# EAGLE design Stepper_Controller (EAGLE 9.6.2)
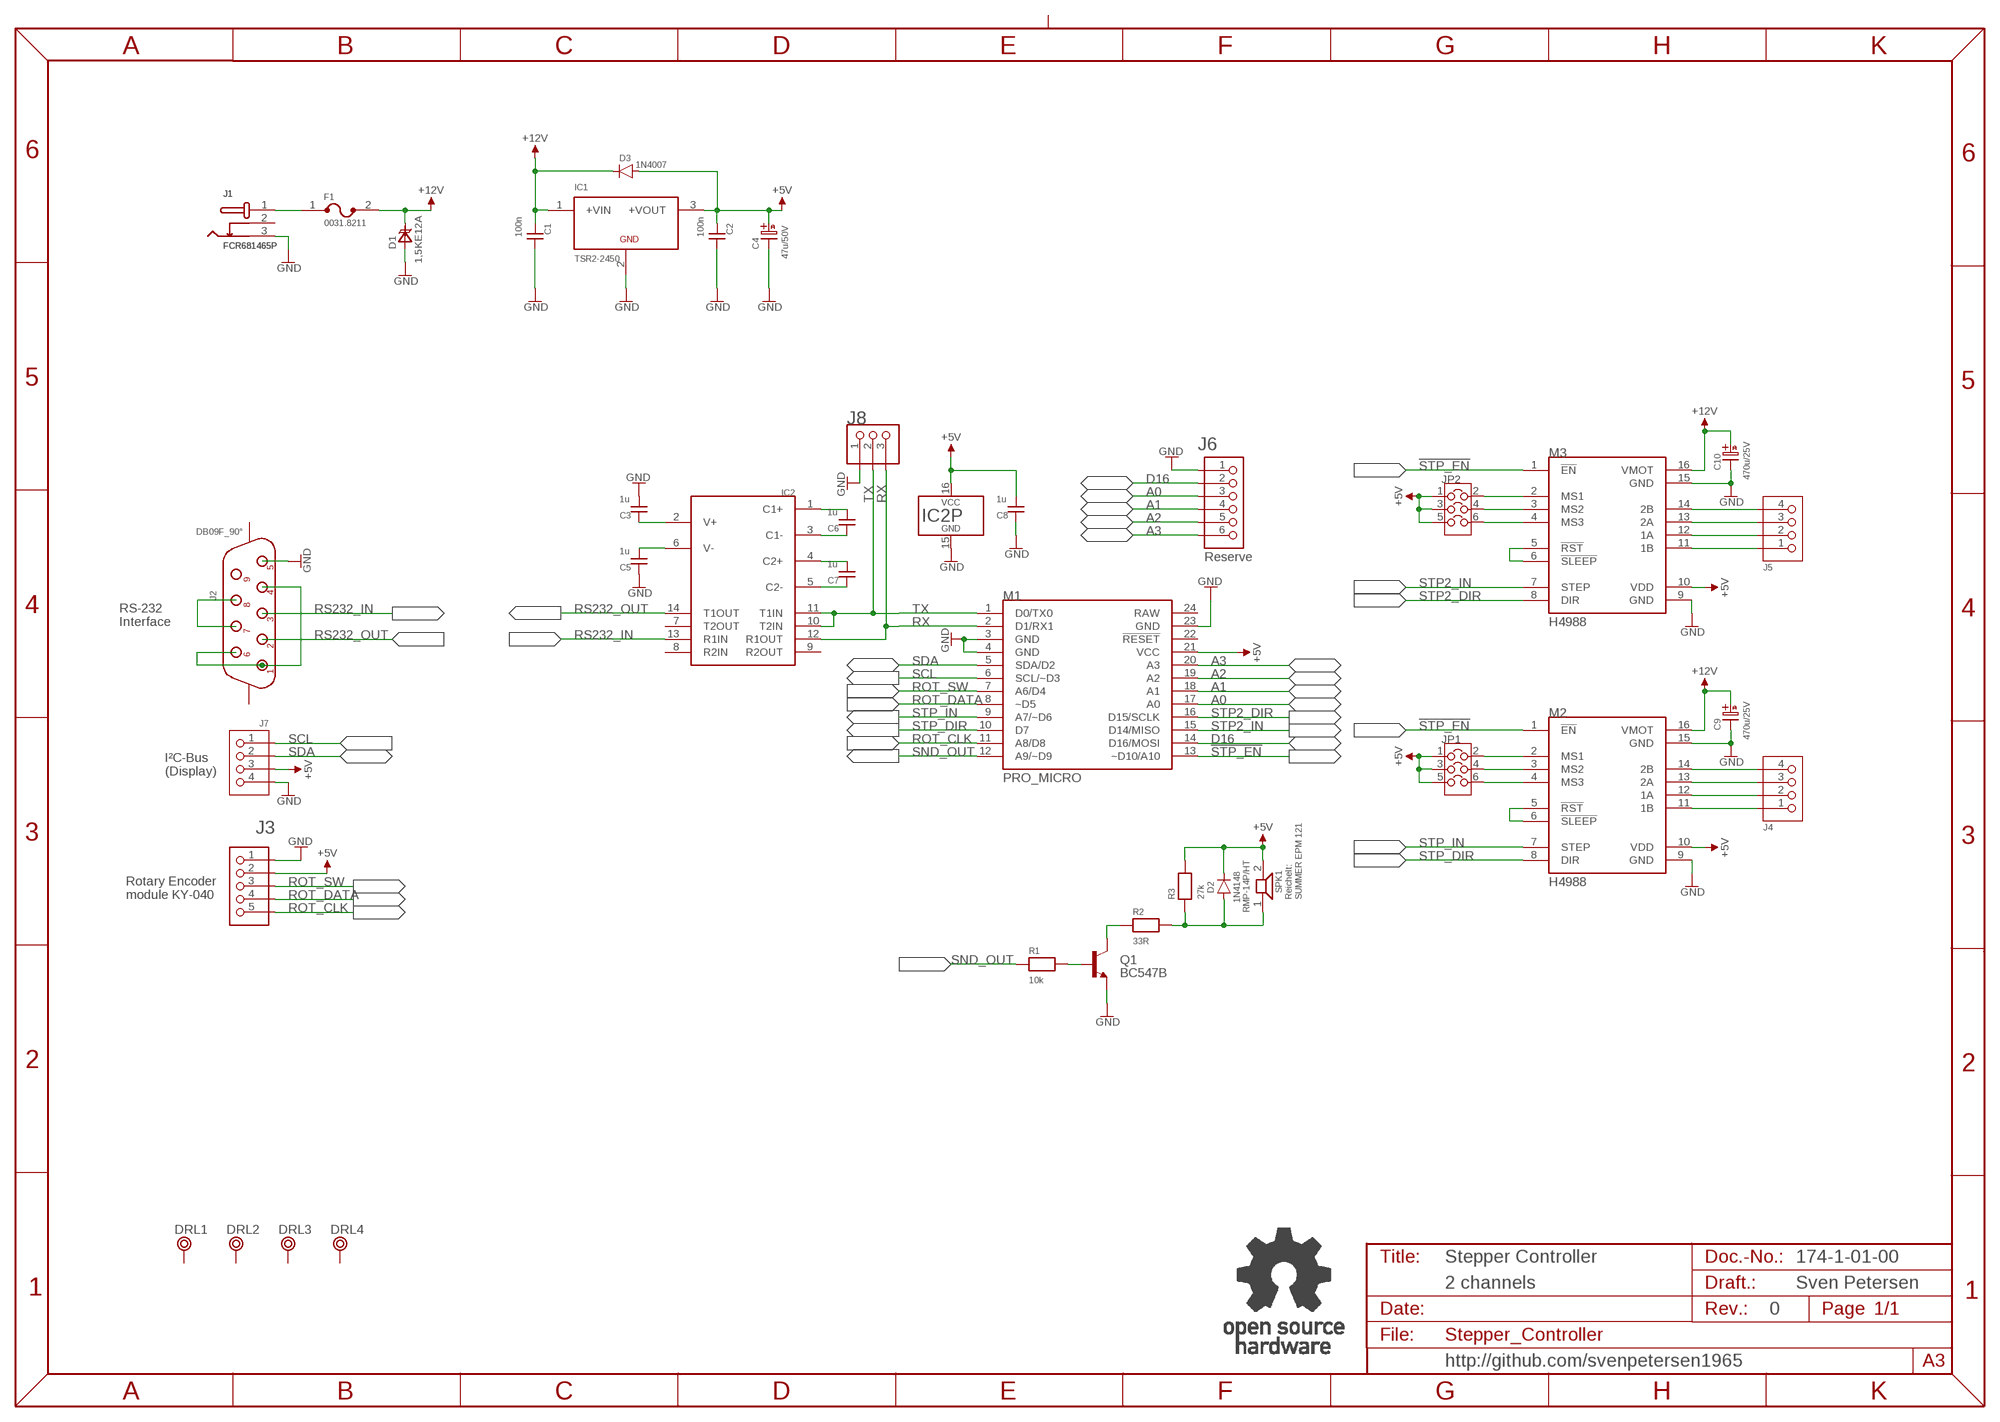
[diagram p0: schematic, sheet 1]

## Parts
C1  100n  CAP01  [C-2,5]
C2  100n  CAP01  [C-2,5]
C3  1u  CAP02  [C-5]
C4  47u/50V  C07/2,5  [C07/2,5]
C5  1u  CAP02  [C-5]
C6  1u  CAP02  [C-5]
C7  1u  CAP02  [C-5]
C8  1u  CAP02  [C-5]
C9  470u/25V  C08/3,5  [C08/3,5]
C10  470u/25V  C08/3,5  [C08/3,5]
D1  1,5KE12A  [DO-201]
D2  1N4148  [DO-35]
D3  1N4007  [DO-41]
DRL1  BOHR3,5  [BOHR3,5]
DRL2  BOHR3,5  [BOHR3,5]
DRL3  BOHR3,5  [BOHR3,5]
DRL4  BOHR3,5  [BOHR3,5]
F1  0031.8211  [0031.8211]
IC1  TSR2-2450  TSR2  [TSR2]
IC2  MAX-232  [DIL-16]
J1  FCR681465P  [FCR681465P]
J2  DB09F_90°  DS09F-H-CL  [DS09F-H]
J3  6410-5P  [6410-5P]
J4  6410-4P  [6410-4P]
J5  6410-4P  [6410-4P]
J6  PINHD-1X6  [1X06]
J7  6410-4P  [6410-4P]
J8  PINHD-1X3  [1X03]
JP1  COMBI-3X2P  [COMBI-3X2]
JP2  COMBI-3X2P  [COMBI-3X2]
M1  PRO_MICRO  [PRO_MICRO]
M2  H4988  [H4988]
M3  H4988  [H4988]
Q1  BC547B  [TO92]
R1  10k  RES04  [R-10]
R2  33R  RES04  [R-10]
R3  27k  RES04  [R-10]
SPK1  RMP-14P/HT  [RMP-14P/HT]
U$2  OPEN_SOURCE_HW  [OPENHW]

## Nets
!STP_EN: M1.13(~D10/A10) M2.1(!EN) M3.1(!EN)
+5V: C2.1 C4.A(+) C8.2 D2.K D3.A IC1.3(+VOUT) IC2.16(VCC) J3.2 J7.3 JP1.1 JP1.3 JP1.5 JP2.1 JP2.3 JP2.5 M1.21(VCC) M2.10(VDD) M3.10(VDD) R3.2 SPK1.2
+12V: C1.1 C9.+ C10.+ D1.K D3.K F1.2 IC1.1(+VIN) M2.16(VMOT) M3.16(VMOT)
A0: J6.3 M1.17(A0)
A1: J6.4 M1.18(A1)
A2: J6.5 M1.19(A2)
A3: J6.6 M1.20(A3)
D16: J6.2 M1.14(D16/MOSI)
GND: C1.2 C2.2 C3.2 C4.K(-) C5.1 C8.1 C9.- C10.- D1.A IC1.2(GND) IC2.15(GND) J1.3 J2.5 J3.1 J6.1 J7.4 J8.1 M1.3(GND) M1.4(GND) M1.23(GND) M2.9(GND) M2.15(GND) M3.9(GND) M3.15(GND) Q1.1(E)
N$1: F1.1 J1.1
N$2: Q1.3(C) R2.1
N$3: Q1.2(B) R1.2
N$4: J2.1 J2.4 J2.6
N$5: J2.7 J2.8
N$6: C7.2 IC2.4(C2+)
N$7: C7.1 IC2.5(C2-)
N$8: C6.1 IC2.3(C1-)
N$9: C6.2 IC2.1(C1+)
N$10: D2.A R2.2 R3.1 SPK1.1
N$11: C3.1 IC2.2(V+)
N$12: C5.2 IC2.6(V-)
N$13: M2.5(!RST) M2.6(!SLEEP)
N$14: M3.5(!RST) M3.6(!SLEEP)
N$15: JP2.2 M3.2(MS1)
N$16: JP2.4 M3.3(MS2)
N$17: JP2.6 M3.4(MS3)
N$18: JP1.2 M2.2(MS1)
N$19: JP1.4 M2.3(MS2)
N$20: JP1.6 M2.4(MS3)
N$21: J4.1 M2.11(1B)
N$22: J4.2 M2.12(1A)
N$23: J4.3 M2.13(2A)
N$24: J4.4 M2.14(2B)
N$25: J5.1 M3.11(1B)
N$26: J5.2 M3.12(1A)
N$27: J5.3 M3.13(2A)
N$28: J5.4 M3.14(2B)
ROT_CLK: J3.5 M1.11(A8/D8)
ROT_DATA: J3.4 M1.8(~D5)
ROT_SW: J3.3 M1.7(A6/D4)
RS232_IN: IC2.13(R1IN) J2.3
RS232_OUT: IC2.14(T1OUT) J2.2
RX: IC2.12(R1OUT) J8.3 M1.2(D1/RX1)
SCL: J7.1 M1.6(SCL/~D3)
SDA: J7.2 M1.5(SDA/D2)
SND_OUT: M1.12(A9/~D9) R1.1
STP2_DIR: M1.16(D15/SCLK) M3.8(DIR)
STP2_IN: M1.15(D14/MISO) M3.7(STEP)
STP_DIR: M1.10(D7) M2.8(DIR)
STP_IN: M1.9(A7/~D6) M2.7(STEP)
TX: IC2.10(T2IN) IC2.11(T1IN) J8.2 M1.1(D0/TX0)
Unconnected: DRL1.P$1 DRL2.P$1 DRL3.P$1 DRL4.P$1 IC2.7(T2OUT) IC2.8(R2IN) IC2.9(R2OUT) J1.2 J2.9 J2.PE1 J2.PE2 M1.22(!RESET)

## Notes on the sheet
- Reserve
- RS-232 
  Interface
- I²C-Bus
  (Display)
- Rotary Encoder
  module KY-040
- Reichelt:
  SUMMER EPM 121
- Stepper Controller | 174-1-01-00
- 2 channels | Sven Petersen
- 0
- http://github.com/svenpetersen1965

## Power pins joined to a net without a drawn wire
RAW: M1.24(RAW)

## Library data of the parts
C1 C2 = DISCRETE:CAP01
C3 C5-C8 = DISCRETE:CAP02
C4 = ELCO:C07/2,5
C9 C10 = ELCO:C08/3,5
D1 = ST:1,5KE12A
D2 = Dioden:1N4148
D3 = Dioden:1N4007
DRL1-DRL4 = Mech_Bohr:BOHR3,5
F1 = Schurter:0031.8211
IC1 = Traco:TSR2
IC2 = MAXIM:MAX-232
J1 = Cliff:FCR681465P
J2 = Connec:DS09F-H-CL
J3 = MOLEX:6410-5P: 6410/22-27-2051
J4 J5 J7 = MOLEX:6410-4P: 6410/22-27-2041
J6 = PINHEAD:PINHD-1X6
J8 = PINHEAD:PINHD-1X3
JP1 JP2 = Cutpad:COMBI-3X2P
M1 = Arduino:PRO_MICRO
M2 M3 = modules:H4988
Q1 = Transistoren:BC547*: NPN Transistor
R1-R3 = DISCRETE:RES04
SPK1 = KM:RMP-14P/HT
U$2 = Logo:OPEN_SOURCE_HW

## Board
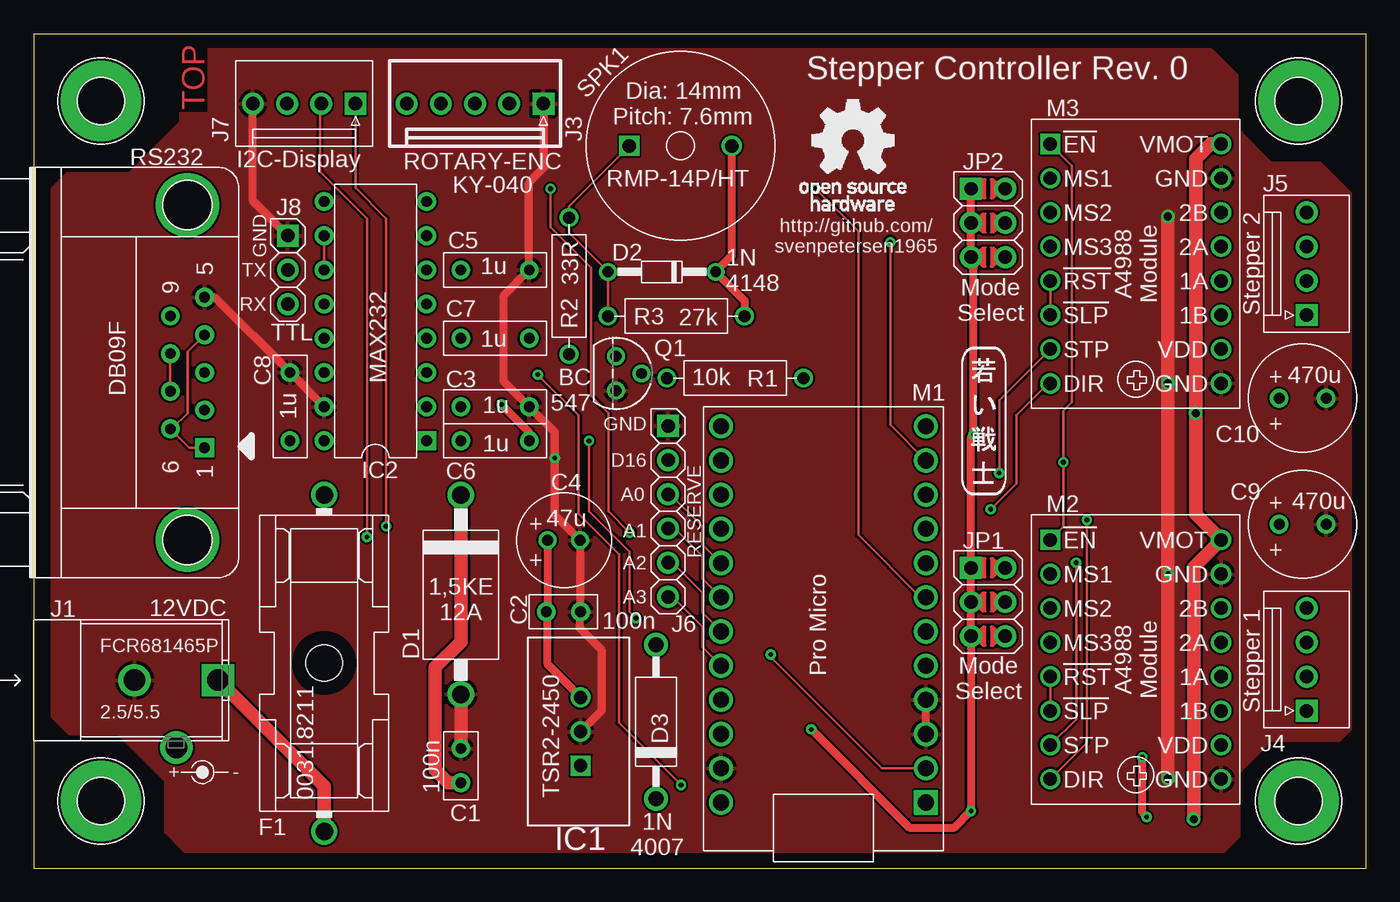
[diagram p1: board, top side]
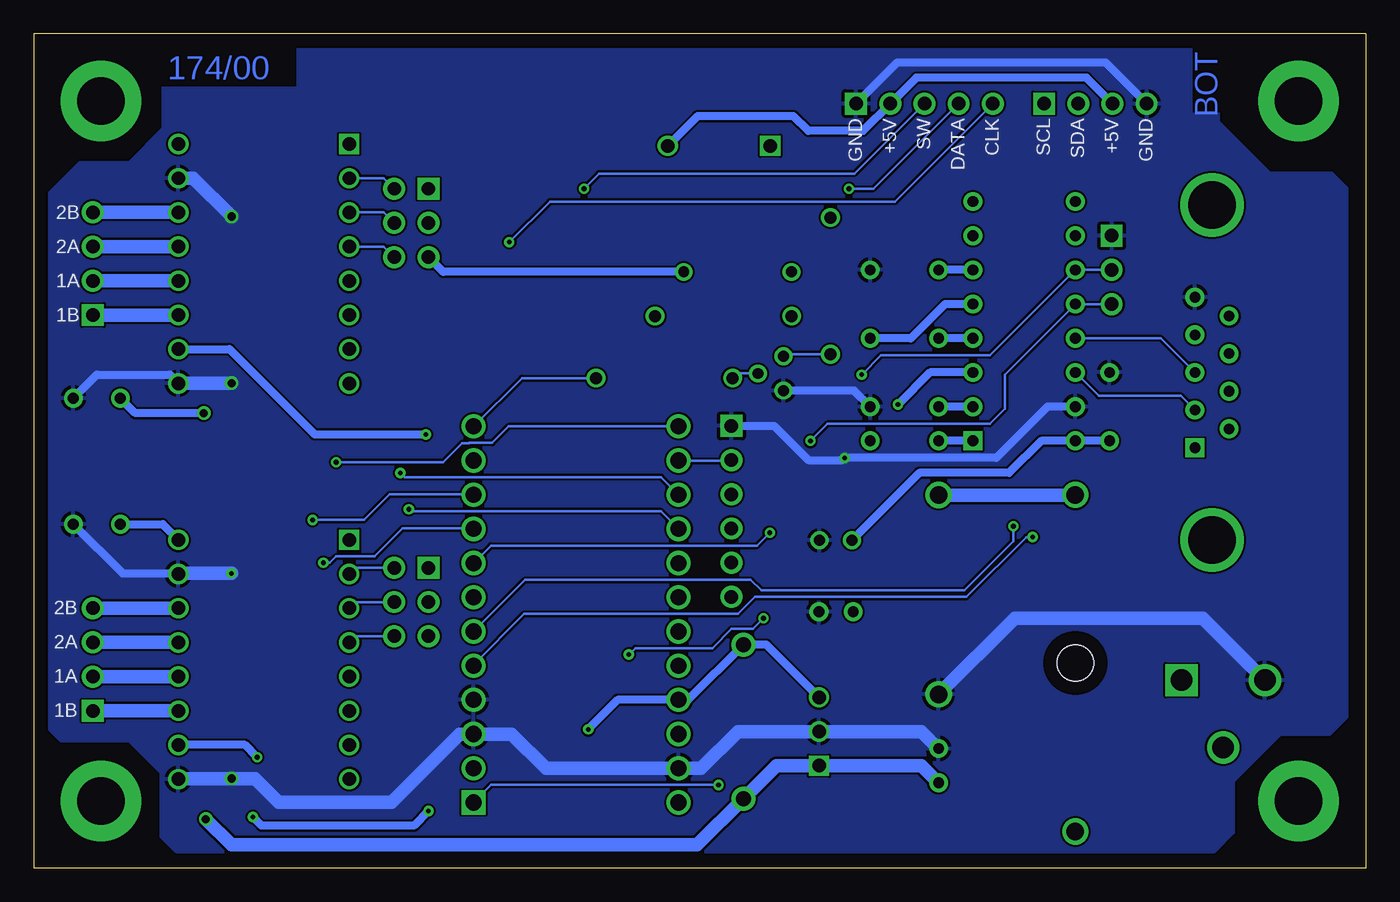
[diagram p2: board, bottom side, seen from below]

Size 99 x 62 mm. Coordinates in mm from the lower left corner, seen from the top.
Outline: 0,0 99,0 99,62 0,62 0,0
Copper layers (1*16): Top 0.035mm / dielectric 1.5mm / Bottom 0.035mm
Design rules "default *": minimum track width 6mil, minimum drill 0.35mm, track to track 6mil, track to pad 6mil, pad to pad 6mil, via to via 6mil, smd to smd 6mil, copper to edge 40mil, drill to drill 6mil, minimum pad ring 10mil, minimum via ring 8mil, stop-mask expansion 4mil, vias tented up to drill 25mil, thermal gap 10mil
bRestrict: 2 lines

### Footprints (pad centres in the part's own frame; a part is rotated, then mirrored left to right if it is on the bottom)
C-2,5 = drill 0.8 pad 1.397: 1 -1.27,0; 2 1.27,0
C-5 = drill 0.8 pad 1.397: 1 -2.54,0; 2 2.54,0
C07/2,5 = drill 0.813 pad 1.27: A -1.202,0; K 1.202,0
C08/3,5 = drill 0.813 pad 1.397: + -1.746,0; - 1.746,0
DO-201 = drill 1.3: A -7.4,0; K 7.4,0
DO-35 = drill 0.8: A -4,0; K 4,0
DO-41 = drill 1.118 pad 1.778: A 5.715,0; K -5.715,0
BOHR3,5 = drill 3.5 pad 6: P$1 0,0
0031.8211 = drill 1.3: 1 -12.5,0; 2 12.5,0 | hole 2.7: 0,0
TSR2 = drill 1 square: 1 -2.54,0 | drill 1: 2 0,0; 3 2.54,0
DIL-16 = drill 0.8 pad 1.397 square: 1 -7.62,-3.81 | drill 0.8 pad 1.397: 2 -5.08,-3.81; 3 -2.54,-3.81; 4 0,-3.81; 5 2.54,-3.81; 6 5.08,-3.81; 7 7.62,-3.81; 8 10.16,-3.81; 9 10.16,3.81; 10 7.62,3.81; 11 5.08,3.81; 12 2.54,3.81; 13 0,3.81; 14 -2.54,3.81; 15 -5.08,3.81; 16 -7.62,3.81
FCR681465P = drill 1.6 square: 1 0,13.7 | drill 1.6: 2 5,10.6; 3 0,7.5
DS09F-H = drill 0.787 pad 1.397 square: 1 -5.588,-1.27 | drill 0.787 pad 1.397: 2 -2.794,-1.27; 3 0,-1.27; 4 2.794,-1.27; 5 5.588,-1.27; 6 -4.191,1.27; 7 -1.397,1.27; 8 1.397,1.27; 9 4.191,1.27 | drill 3.505 pad 4.724: PE1 -12.446,0; PE2 12.446,0
6410-5P = drill 1 pad 1.626 square: 1 -5.08,0 | drill 1 pad 1.626: 2 -2.54,0; 3 0,0; 4 2.54,0; 5 5.08,0
6410-4P = drill 1 pad 1.626 square: 1 -3.81,0 | drill 1 pad 1.626: 2 -1.27,0; 3 1.27,0; 4 3.81,0
1X06 = drill 1 pad 1.626 square: 1 -6.35,0 | drill 1 pad 1.626: 2 -3.81,0; 3 -1.27,0; 4 1.27,0; 5 3.81,0; 6 6.35,0
1X03 = drill 1 pad 1.626 square: 1 -2.54,0 | drill 1 pad 1.626: 2 0,0; 3 2.54,0
COMBI-3X2 = drill 1 pad 1.626 square: 1 -1.27,2.54 | drill 1 pad 1.626: 2 1.27,2.54; 3 -1.27,0; 4 1.27,0; 5 -1.27,-2.54; 6 1.27,-2.54
PRO_MICRO = drill 1.2 square: 1 -7.62,13.97 | drill 1.2: 2 -7.62,11.43; 3 -7.62,8.89; 4 -7.62,6.35; 5 -7.62,3.81; 6 -7.62,1.27; 7 -7.62,-1.27; 8 -7.62,-3.81; 9 -7.62,-6.35; 10 -7.62,-8.89; 11 -7.62,-11.43; 12 -7.62,-13.97; 13 7.62,-13.97; 14 7.62,-11.43; 15 7.62,-8.89; 16 7.62,-6.35; 17 7.62,-3.81; 18 7.62,-1.27; 19 7.62,1.27; 20 7.62,3.81; 21 7.62,6.35; 22 7.62,8.89; 23 7.62,11.43; 24 7.62,13.97
H4988 = drill 1 square: 1 -6.35,8.89 | drill 1: 2 -6.35,6.35; 3 -6.35,3.81; 4 -6.35,1.27; 5 -6.35,-1.27; 6 -6.35,-3.81; 7 -6.35,-6.35; 8 -6.35,-8.89; 9 6.35,-8.89; 10 6.35,-6.35; 11 6.35,-3.81; 12 6.35,-1.27; 13 6.35,1.27; 14 6.35,3.81; 15 6.35,6.35; 16 6.35,8.89
TO92 = drill 0.813: 1 1.27,0; 2 0,1.905; 3 -1.27,0
R-10 = drill 0.889 pad 1.397: 1 -5.08,0; 2 5.08,0
RMP-14P/HT = drill 1 square: 1 0,3.8 | drill 1: 2 0,-3.8

### Placement (x,y rotation side)
C1  31.75,7.62 90 top
C2  39.37,19.05 0 top
C3  34.29,34.29 0 top
C4  39.4,24.36 0 top
C5  34.29,44.45 180 top
C6  34.29,31.75 180 top
C7  34.29,39.37 180 top
C8  19.05,34.29 270 top
C9  94.3,25.56 0 top
C10  94.3,34.92 0 top
D1  31.75,20.32 90 top
D2  46.69,44.3 0 top
D3  46.26,10.89 90 top
DRL1  5,5 0 top
DRL2  5,57 0 top
DRL3  94,5 0 top
DRL4  94,57 0 top
F1  21.59,15.24 90 top
IC1  40.64,10.16 90 top
IC2  25.4,39.37 90 top
J1  0,13.97 270 top
J2  11.43,36.83 90 top
J3  32.8,56.8 180 top
J4  94.6,15.51 90 top
J5  94.6,44.91 90 top
J6  47.15,26.51 270 top
J7  20.1,56.8 180 top
J8  18.89,44.45 270 top
JP1  70.93,19.78 0 top
JP2  70.93,47.94 0 top
M1  58.69,18.86 180 top
M2  81.9,15.51 0 top
M3  81.9,44.91 0 top
Q1  43.27,36.76 270 top
R1  52.13,36.42 180 top
R2  39.78,43.26 90 top
R3  47.75,41.02 0 top
SPK1  48.07,53.67 90 top
U$2  56.95,48.84 0 top
U$59  [PCB-TITLE/]  0,72 0 top  (outside the outline)
U$71  [SVEN_TAG]  70.64,33.34 0 top
U$77  [2LAYER]  12.7,56.36 90 top

### Tracks (layer width: path | path; a pad name or v marks a point on that pad's centre or on a via)
!STP_EN  (via drill 0.35)
  Top 0.203: M2.1 76.52,25.37 v76.52,30.16 76.52,33.97 77.15,34.61 77.15,52.2 M3.1
  Bottom 0.203: M1.13 63.69,32.83 64.92,31.6 66.63,31.6 66.64,31.59 67.15,31.59 68.58,30.16 v76.52,30.16
+5V  (via drill 0.35)
  Top 0.61: JP2.1 JP2.3 JP2.5 69.66,44.81 69.85,44.63 v69.85,32.23 69.66,32.04 JP1.1 JP1.3 JP1.5 v69.66,4.25 68.42,3.02 65.09,3.02 v57.78,10.32 | C4.A 38.2,19.15 | 38.2,19.15 C2.1 | SPK1.2 51.87,45.49 D2.K 52.83,42.16 R3.2 | IC1.3 38.2,15.14 38.2,19.15 | v82.71,3.81 82.39,4.13 v82.39,8.26
  Bottom 0.61: M3.10 84.44,38.56 78.11,32.23 v69.85,32.23 | C8.2 IC2.16 24.13,31.75 26.51,29.37 33.18,29.37 38.19,24.36 C4.A | J7.3 20.77,58.74 33.4,58.74 J3.2 37.37,54.77 41.43,54.77 42.55,55.88 49.66,55.88 SPK1.2 | IC1.3 44.55,16.61 D3.A 50.35,12.51 M1.21 55.59,12.51 v57.78,10.32 | v69.66,4.25 70.74,3.17 82.07,3.17 v82.71,3.81 | v82.39,8.26 83.3,9.16 M2.10 | D2.K 68.56,44.3 JP2.5
+12V  (via drill 0.6)
  Top 1.016: C1.1 30.8,6.35 29.84,7.3 29.84,14.92 31.75,16.83 D1.K | M3.16 88.23,53.82 87.47,53.82 86.36,52.7 v86.36,33.81 86.36,26.29 M2.16 86.2,22.35 v86.2,3.65
  Bottom 0.61: C9.+ 89.41,25.56 M2.16 | v86.36,33.81 91.44,33.81 C10.+
  Bottom 1.016: C1.1 33.02,7.62 IC1.1 43.81,7.62 D3.K 49.69,1.75 84.3,1.75 v86.2,3.65 | D1.K 21.61,27.72 F1.2
A0
  Top 0.203: M1.17 49.69,24.05 49.69,25.4 47.31,27.78 J6.3
A1
  Top 0.203: M1.18 49.69,21.51 49.69,23.18 47.62,25.24 J6.4
A2
  Top 0.203: M1.19 49.69,18.97 49.69,20.48 47.47,22.7 J6.5
A3
  Top 0.203: M1.20 49.69,16.43 49.69,17.94 47.47,20.16 J6.6
D16
  Bottom 0.203: M1.14 47.18,30.29 J6.2
GND  (via drill 0.35, 0.6)
  Top 0.61: M1.3 M1.4 | 40.6,19.09 C4.K 38.73,26.23 v38.73,30.48 38.73,32.38 C3.2 34.92,36.2 34.92,42.55 C5.1 36.83,50.96 37.94,52.07 37.94,56.74 J3.1 | 40.6,19.09 C2.2 | IC1.2 42.23,11.75 42.23,16.19 40.6,17.82 40.6,19.09 | IC2.15 C8.1 13.46,42.42 J2.5 | J8.1 16.29,49.59 J7.4
  Top 1.016: D1.A C1.2 | v84.3,6.67 v84.3,21.91 v84.3,36.04 v84.3,48.42
  Bottom 0.61: IC2.15 23.65,34.29 27.46,30.48 v38.73,30.48 38.89,30.32 41.43,30.32 43.97,32.86 J6.1 | J7.4 19.34,59.85 34.83,59.85 J3.1 | C3.2 38.03,35.49 Q1.1 | C10.- 94.3,36.67 88.87,36.67 88.23,36.04 | C9.- 92.39,21.91 88.2,21.91
  Bottom 1.016: J1.3 12.1,18.57 26.1,18.57 D1.A | C1.2 33.02,10.16 IC1.2 46.67,10.16 49.4,7.43 M1.23 60.93,7.43 63.47,9.97 M1.3 67.34,9.97 72.39,4.92 80.8,4.92 82.55,6.67 v84.3,6.67 88.2,6.67 M2.9 | v84.3,21.91 88.2,21.91 M2.15 | v84.3,36.04 88.23,36.04 M3.9 | v84.3,48.42 87.14,51.26 M3.15
  pour Top: 2.54,51.59 7.14,51.59 10.95,55.4 10.95,59.21 12.54,60.8 87.47,60.8 89.38,58.9 89.38,54.93 91.92,52.39 95.57,52.39 97.95,50.01 97.95,10.48 97,9.53 91.92,9.53 89.53,7.14 89.53,2.38 88.42,1.27 11.27,1.27 9.84,2.7 9.84,6.51 6.35,10 2.7,10 1.43,11.27 1.43,50.48
  pour Bottom: 2.54,51.59 7.14,51.59 10.95,55.4 10.95,59.21 12.54,60.8 87.47,60.8 89.38,58.9 89.38,54.93 91.92,52.39 95.57,52.39 97.95,50.01 97.95,10.48 97,9.53 91.92,9.53 89.53,7.14 89.53,2.38 88.42,1.27 11.27,1.27 9.84,2.7 9.84,6.51 6.35,10 2.7,10 1.43,11.27 1.43,50.48
N$1
  Top 1.016: J1.1 21.59,6.08 F1.1
N$2
  Bottom 0.203: R2.1 43.12,38.18 Q1.3
N$3
  Bottom 0.203: Q1.2 46.71,36.76 R1.2
N$4
  Top 0.203: J2.4 11.43,38.35 11.43,33.81 10.26,32.64 J2.6 11.56,31.24 J2.1
N$5
  Top 0.203: J2.7 J2.8
N$6
  Bottom 0.61: IC2.4 C7.2
N$7
  Bottom 0.61: IC2.5 31.27,41.91 33.81,39.37 C7.1
N$8  (via drill 0.35)
  Top 0.61: v34.77,34.45 36.83,32.38 C6.1
  Bottom 0.61: IC2.3 32.38,36.83 v34.77,34.45
N$9
  Bottom 0.61: IC2.1 C6.2
N$10
  Top 0.203: R2.2 39.78,48.42 | 39.78,48.42 39.78,49.19 SPK1.1 | R3.1 42.67,44.29 D2.A 39.78,47.21 39.78,48.42
N$11
  Bottom 0.61: IC2.2 C3.1
N$12
  Bottom 0.61: IC2.6 C5.2
N$13
  Top 0.203: M2.6 M2.5
N$14
  Top 0.203: M3.6 M3.5
N$15
  Bottom 0.203: JP2.2 72.98,51.26 M3.2
N$16
  Bottom 0.203: JP2.4 72.98,48.72 M3.3
N$17
  Bottom 0.203: JP2.6 72.98,46.18 M3.4
N$18
  Bottom 0.203: JP1.2 75.09,22.32 M2.2
N$19
  Bottom 0.203: JP1.4 75.09,19.78 M2.3
N$20
  Bottom 0.203: JP1.6 75.09,17.24 M2.4
N$21
  Bottom 1.016: M2.11 J4.1
N$22
  Bottom 1.016: M2.12 J4.2
N$23
  Bottom 1.016: M2.13 J4.3
N$24
  Bottom 1.016: M2.14 J4.4
N$25
  Bottom 1.016: M3.11 J5.1
N$26
  Bottom 1.016: M3.12 J5.2
N$27
  Bottom 1.016: M3.13 J5.3
N$28
  Bottom 1.016: M3.14 J5.4
ROT_CLK  (via drill 0.35)
  Top 0.203: M1.11 63.66,32.94 v63.66,46.51
  Bottom 0.203: J3.5 34.99,49.53 60.64,49.53 v63.66,46.51
ROT_DATA  (via drill 0.35)
  Top 0.203: v44.29,24.92 42.7,26.51 42.7,33.81 41.43,35.08 41.43,44.61 38.42,47.62 v38.42,50.48
  Bottom 0.203: M1.8 65.01,23.97 45.24,23.97 v44.29,24.92 | v38.42,50.48 36.58,50.48 J3.4
ROT_SW  (via drill 0.35)
  Top 0.203: v58.1,50.48 61.28,47.31 61.28,24.77 65.91,20.13 M1.7
  Bottom 0.203: v58.1,50.48 56.99,51.59 38.01,51.59 J3.3
RS232_IN
  Bottom 0.203: J2.3 15.24,39.37 IC2.13
RS232_OUT
  Bottom 0.203: J2.2 13.75,35.08 19.84,35.08 IC2.14
RX  (via drill 0.35)
  Top 0.203: v41.27,31.75 41.27,26.51 44.29,23.5 44.29,19.05 v44.77,18.57 | v54.77,15.88 54.77,15.72 63.05,7.43 M1.2
  Bottom 0.203: v41.27,31.75 40.01,33.02 27.94,33.02 26.83,34.13 26.83,36.67 IC2.12 J8.3 | v44.77,18.57 45.56,17.78 47.15,17.78 48.57,16.36 54.28,16.36 v54.77,15.88
SCL  (via drill 0.35)
  Top 0.203: v26.19,25.4 26.19,48.26 23.91,50.54 J7.1
  Bottom 0.203: M1.6 62.47,21.43 45.72,21.43 44.93,20.64 29.84,20.64 26.19,24.29 v26.19,25.4
SDA  (via drill 0.35)
  Top 0.203: v24.77,24.61 24.77,48.26 21.27,51.75 21.27,56.7 J7.2
  Bottom 0.203: M1.5 66.31,15.13 62.55,18.89 46.67,18.89 45.4,20.16 29.69,20.16 25.24,24.61 v24.77,24.61
SND_OUT
  Bottom 0.203: M1.12 62.72,36.42 R1.1
STP2_DIR  (via drill 0.35)
  Top 0.203: v71.12,26.67 73.03,28.57 73.03,33.66 75.39,36.02 M3.8
  Bottom 0.203: M1.16 52.37,26.51 70.96,26.51 v71.12,26.67
STP2_IN  (via drill 0.35)
  Top 0.203: v71.75,29.37 71.75,34.77 M3.7
  Bottom 0.203: M1.15 52.37,29.05 71.44,29.05 v71.75,29.37
STP_DIR  (via drill 0.35)
  Top 0.203: M2.8 78.26,9.33 v78.26,25.88
  Bottom 0.203: v78.26,25.88 74.45,25.88 72.55,27.78 66.34,27.78 M1.10
STP_IN  (via drill 0.35)
  Top 0.203: M2.7 77.47,11.08 v77.47,22.7
  Bottom 0.203: v77.47,22.7 76.99,22.7 76.52,23.18 73.66,23.18 71.6,25.24 66.34,25.24 M1.9
TX  (via drill 0.35)
  Top 0.203: IC2.11 IC2.10 | v37.47,36.67 40.48,33.66 40.48,26.67 40.48,26.35 41.91,24.92 43.5,23.34 43.5,10.79 v48.1,6.19
  Bottom 0.203: v37.47,36.67 36.04,38.1 27.94,38.1 IC2.11 J8.2 | v48.1,6.19 65.01,6.19 M1.1

### Text on the board
Bottom: 174/00
tPlace: Stepper Controller Rev. 0 | Dia: 14mm | Pitch: 7.6mm | RS232 | I2C-Display | ROTARY-ENC | RMP-14P/HT | KY-040 | GND | http://github.com/ / svenpetersen1965 | Stepper 2 | TX | 1u | 33R | 1N / 4148 | RX | Mode / Select | 27k | TTL | 1u | MAX232 | 10k | 470u | DB09F | 1u | BC / 547 | 1u | GND | 1u | D16 | A0 | RESERVE | 470u | 47u | A1 | A2 | A3 | 12VDC | 1,5KE / 12A | 100n | FCR681465P | Stepper 1 | Pro Micro | Mode / Select | 2.5/5.5 | + | - | 100n | 0031.8211 | TSR2-2450 | 1N / 4007
bPlace: GND | +5V | SDA | SCL | CLK | DATA | SW | +5V | GND | 2B | 2A | 1A | 1B | 2B | 2A | 1A | 1B
Measures: 4- 3.5
Document: Sven Petersen | 174-2-01-00 | 2021 | 35µm | 2 | 0